# EAGLE schematic axiom_beta_power_board_v2.23.72e5f046 (EAGLE 7.7.0), part 2 of 2
## Sheet 14 of 17
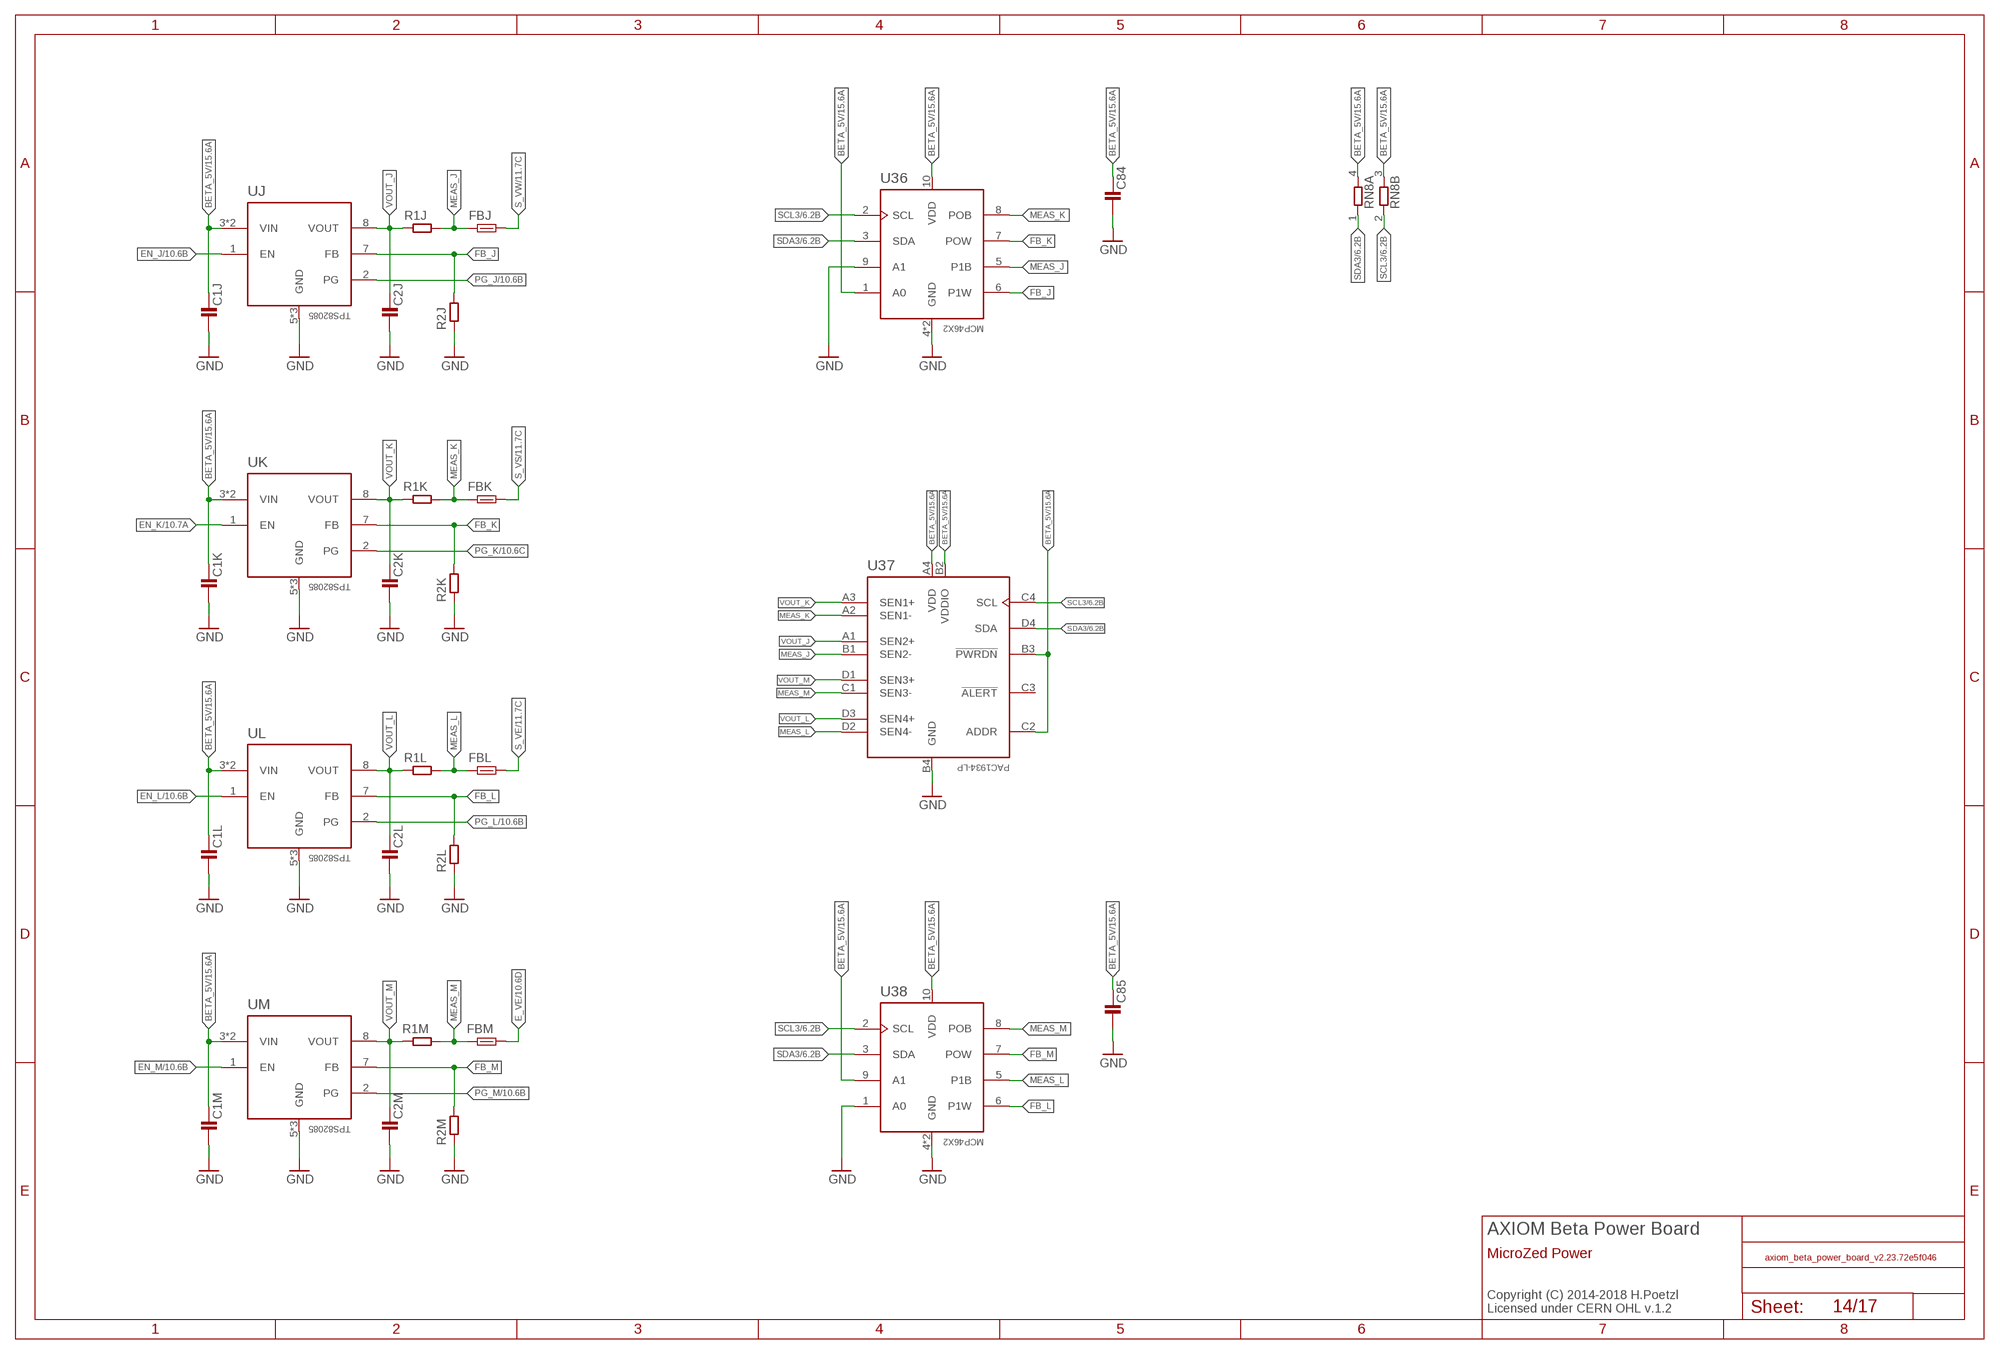
[diagram p14: schematic, sheet 14]

### Parts
C1J  C0603-C  [0603-C]
C1K  C0603-C  [0603-C]
C1L  C0603-C  [0603-C]
C1M  C0603-C  [0603-C]
C2J  C0603-C  [0603-C]
C2K  C0603-C  [0603-C]
C2L  C0603-C  [0603-C]
C2M  C0603-C  [0603-C]
C84  C0402-C  [0402-C]
C85  C0402-C  [0402-C]
FBJ  FB0603-C  [0603-C]
FBK  FB0603-C  [0603-C]
FBL  FB0603-C  [0603-C]
FBM  FB0603-C  [0603-C]
R1J  R0603-C  [0603-C]
R1K  R0603-C  [0603-C]
R1L  R0603-C  [0603-C]
R1M  R0603-C  [0603-C]
R2J  R0402-C  [0402-C]
R2K  R0402-C  [0402-C]
R2L  R0402-C  [0402-C]
R2M  R0402-C  [0402-C]
RN8  2R-NEXB24V  [EXB24V]
U36  MCP46X2  [DFN-10]
U37  PAC1934-LP  [WLCSP-16-LP]
U38  MCP46X2  [DFN-10]
UJ  TPS82085  [MICROSIP]
UK  TPS82085  [MICROSIP]
UL  TPS82085  [MICROSIP]
UM  TPS82085  [MICROSIP]

### Nets
BETA_5V: C1J.1 C1K.1 C1L.1 C1M.1 C84.1 C85.1 RN8.3 RN8.4 U36.1(A0) U36.10(VDD) U37.A4(VDD) U37.B2(VDDIO) U37.B3(!PWRDN) U37.C2(ADDR) U38.9(A1) U38.10(VDD) UJ.3(VIN) UJ.4(VIN) UK.3(VIN) UK.4(VIN) UL.3(VIN) UL.4(VIN) UM.3(VIN) UM.4(VIN) ; also sheet 6,7,8,12,13,15,16,17
E_VE: FBM.2 ; also sheet 10,11
EN_J: UJ.1(EN) ; also sheet 10
EN_K: UK.1(EN) ; also sheet 10
EN_L: UL.1(EN) ; also sheet 10
EN_M: UM.1(EN) ; also sheet 10
FB_J: R2J.2 U36.6(P1W) UJ.7(FB)
FB_K: R2K.2 U36.7(POW) UK.7(FB)
FB_L: R2L.2 U38.6(P1W) UL.7(FB)
FB_M: R2M.2 U38.7(POW) UM.7(FB)
GND: C1J.2 C1K.2 C1L.2 C1M.2 C2J.2 C2K.2 C2L.2 C2M.2 C84.2 C85.2 R2J.1 R2K.1 R2L.1 R2M.1 U36.4(GND) U36.9(A1) U36.EP(GND) U37.B4(GND) U38.1(A0) U38.4(GND) U38.EP(GND) UJ.5(GND) UJ.6(GND) UJ.EP(GND) UK.5(GND) UK.6(GND) UK.EP(GND) UL.5(GND) UL.6(GND) UL.EP(GND) UM.5(GND) UM.6(GND) UM.EP(GND) ; also sheet 2,3,5,6,7,8,9,10,11,12,13,15,16,17
MEAS_J: FBJ.1 R1J.2 U36.5(P1B) U37.B1(SEN2-)
MEAS_K: FBK.1 R1K.2 U36.8(POB) U37.A2(SEN1-)
MEAS_L: FBL.1 R1L.2 U37.D2(SEN4-) U38.5(P1B)
MEAS_M: FBM.1 R1M.2 U37.C1(SEN3-) U38.8(POB)
PG_J: UJ.2(PG) ; also sheet 10
PG_K: UK.2(PG) ; also sheet 10
PG_L: UL.2(PG) ; also sheet 10
PG_M: UM.2(PG) ; also sheet 10
S_VE: FBL.2 ; also sheet 11
S_VS: FBK.2 ; also sheet 11
S_VW: FBJ.2 ; also sheet 11
SCL3: RN8.2 U36.2(SCL) U37.C4(SCL) U38.2(SCL) ; also sheet 6,10
SDA3: RN8.1 U36.3(SDA) U37.D4(SDA) U38.3(SDA) ; also sheet 6,10
VOUT_J: C2J.1 R1J.1 U37.A1(SEN2+) UJ.8(VOUT)
VOUT_K: C2K.1 R1K.1 U37.A3(SEN1+) UK.8(VOUT)
VOUT_L: C2L.1 R1L.1 U37.D3(SEN4+) UL.8(VOUT)
VOUT_M: C2M.1 R1M.1 U37.D1(SEN3+) UM.8(VOUT)
Unconnected: U37.C3(!ALERT)

### Notes on the sheet
- AXIOM Beta Power Board
- MicroZed Power
- Copyright (C) 2014-2018 H.Poetzl
  Licensed under CERN OHL v.1.2

## Sheet 15 of 17
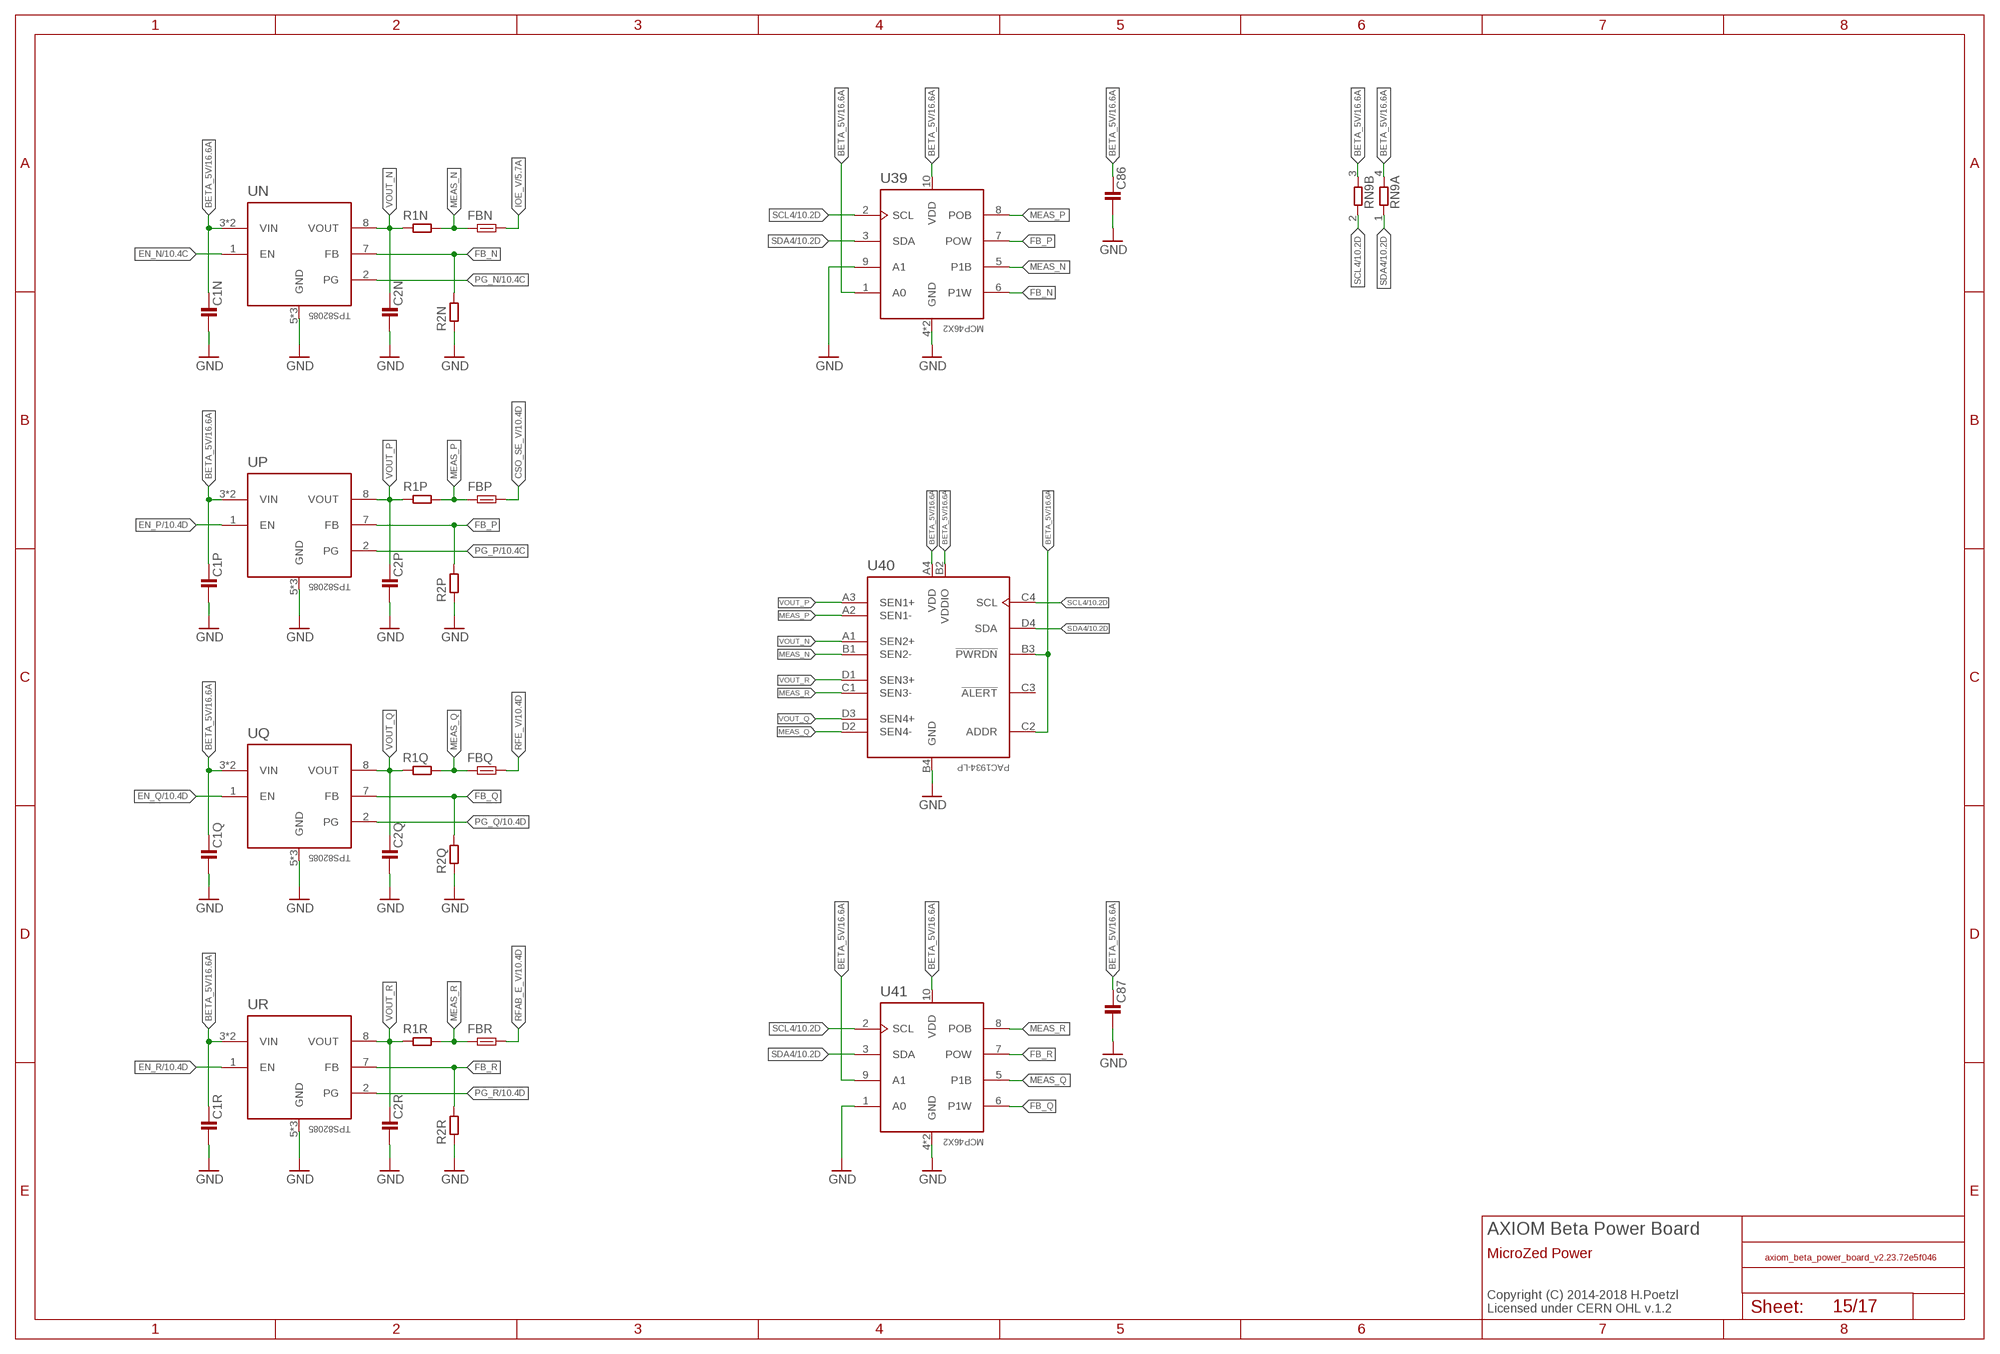
[diagram p15: schematic, sheet 15]

### Parts
C1N  C0603-C  [0603-C]
C1P  C0603-C  [0603-C]
C1Q  C0603-C  [0603-C]
C1R  C0603-C  [0603-C]
C2N  C0603-C  [0603-C]
C2P  C0603-C  [0603-C]
C2Q  C0603-C  [0603-C]
C2R  C0603-C  [0603-C]
C86  C0402-C  [0402-C]
C87  C0402-C  [0402-C]
FBN  FB0603-C  [0603-C]
FBP  FB0603-C  [0603-C]
FBQ  FB0603-C  [0603-C]
FBR  FB0603-C  [0603-C]
R1N  R0603-C  [0603-C]
R1P  R0603-C  [0603-C]
R1Q  R0603-C  [0603-C]
R1R  R0603-C  [0603-C]
R2N  R0402-C  [0402-C]
R2P  R0402-C  [0402-C]
R2Q  R0402-C  [0402-C]
R2R  R0402-C  [0402-C]
RN9  2R-NEXB24V  [EXB24V]
U39  MCP46X2  [DFN-10]
U40  PAC1934-LP  [WLCSP-16-LP]
U41  MCP46X2  [DFN-10]
UN  TPS82085  [MICROSIP]
UP  TPS82085  [MICROSIP]
UQ  TPS82085  [MICROSIP]
UR  TPS82085  [MICROSIP]

### Nets
BETA_5V: C1N.1 C1P.1 C1Q.1 C1R.1 C86.1 C87.1 RN9.3 RN9.4 U39.1(A0) U39.10(VDD) U40.A4(VDD) U40.B2(VDDIO) U40.B3(!PWRDN) U40.C2(ADDR) U41.9(A1) U41.10(VDD) UN.3(VIN) UN.4(VIN) UP.3(VIN) UP.4(VIN) UQ.3(VIN) UQ.4(VIN) UR.3(VIN) UR.4(VIN) ; also sheet 6,7,8,12,13,14,16,17
CSO_SE_V: FBP.2 ; also sheet 10,11
EN_N: UN.1(EN) ; also sheet 10
EN_P: UP.1(EN) ; also sheet 10
EN_Q: UQ.1(EN) ; also sheet 10
EN_R: UR.1(EN) ; also sheet 10
FB_N: R2N.2 U39.6(P1W) UN.7(FB)
FB_P: R2P.2 U39.7(POW) UP.7(FB)
FB_Q: R2Q.2 U41.6(P1W) UQ.7(FB)
FB_R: R2R.2 U41.7(POW) UR.7(FB)
GND: C1N.2 C1P.2 C1Q.2 C1R.2 C2N.2 C2P.2 C2Q.2 C2R.2 C86.2 C87.2 R2N.1 R2P.1 R2Q.1 R2R.1 U39.4(GND) U39.9(A1) U39.EP(GND) U40.B4(GND) U41.1(A0) U41.4(GND) U41.EP(GND) UN.5(GND) UN.6(GND) UN.EP(GND) UP.5(GND) UP.6(GND) UP.EP(GND) UQ.5(GND) UQ.6(GND) UQ.EP(GND) UR.5(GND) UR.6(GND) UR.EP(GND) ; also sheet 2,3,5,6,7,8,9,10,11,12,13,14,16,17
IOE_V: FBN.2 ; also sheet 5,10,11
MEAS_N: FBN.1 R1N.2 U39.5(P1B) U40.B1(SEN2-)
MEAS_P: FBP.1 R1P.2 U39.8(POB) U40.A2(SEN1-)
MEAS_Q: FBQ.1 R1Q.2 U40.D2(SEN4-) U41.5(P1B)
MEAS_R: FBR.1 R1R.2 U40.C1(SEN3-) U41.8(POB)
PG_N: UN.2(PG) ; also sheet 10
PG_P: UP.2(PG) ; also sheet 10
PG_Q: UQ.2(PG) ; also sheet 10
PG_R: UR.2(PG) ; also sheet 10
RFAB_E_V: FBR.2 ; also sheet 10,11
RFE_V: FBQ.2 ; also sheet 10,11
SCL4: RN9.2 U39.2(SCL) U40.C4(SCL) U41.2(SCL) ; also sheet 10
SDA4: RN9.1 U39.3(SDA) U40.D4(SDA) U41.3(SDA) ; also sheet 10
VOUT_N: C2N.1 R1N.1 U40.A1(SEN2+) UN.8(VOUT)
VOUT_P: C2P.1 R1P.1 U40.A3(SEN1+) UP.8(VOUT)
VOUT_Q: C2Q.1 R1Q.1 U40.D3(SEN4+) UQ.8(VOUT)
VOUT_R: C2R.1 R1R.1 U40.D1(SEN3+) UR.8(VOUT)
Unconnected: U40.C3(!ALERT)

### Notes on the sheet
- AXIOM Beta Power Board
- MicroZed Power
- Copyright (C) 2014-2018 H.Poetzl
  Licensed under CERN OHL v.1.2

## Sheet 16 of 17
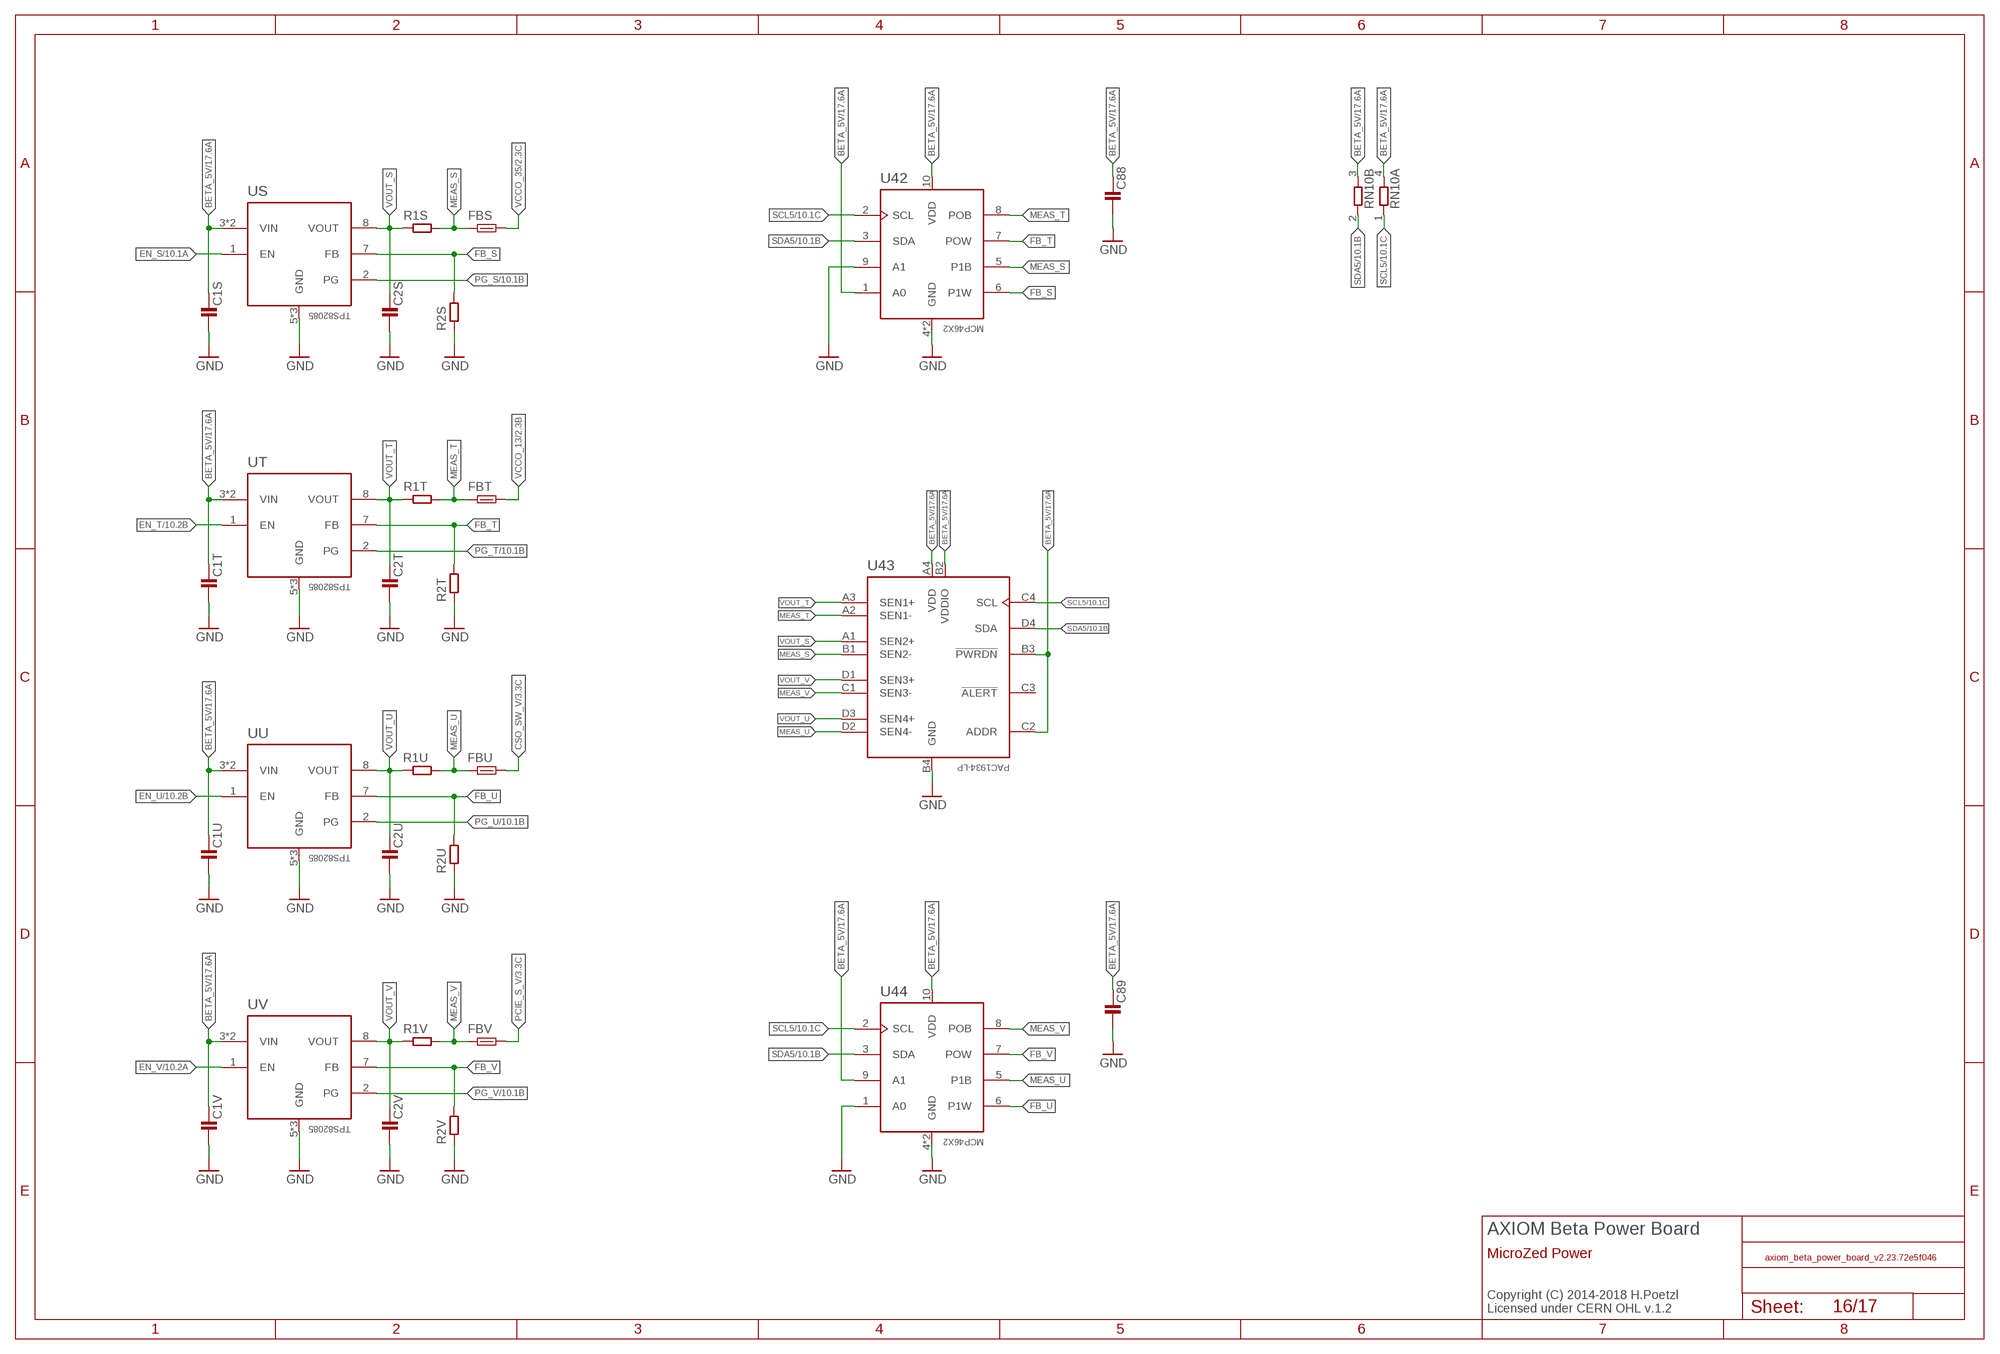
[diagram p16: schematic, sheet 16]

### Parts
C1S  C0603-C  [0603-C]
C1T  C0603-C  [0603-C]
C1U  C0603-C  [0603-C]
C1V  C0603-C  [0603-C]
C2S  C0603-C  [0603-C]
C2T  C0603-C  [0603-C]
C2U  C0603-C  [0603-C]
C2V  C0603-C  [0603-C]
C88  C0402-C  [0402-C]
C89  C0402-C  [0402-C]
FBS  FB0603-C  [0603-C]
FBT  FB0603-C  [0603-C]
FBU  FB0603-C  [0603-C]
FBV  FB0603-C  [0603-C]
R1S  R0603-C  [0603-C]
R1T  R0603-C  [0603-C]
R1U  R0603-C  [0603-C]
R1V  R0603-C  [0603-C]
R2S  R0402-C  [0402-C]
R2T  R0402-C  [0402-C]
R2U  R0402-C  [0402-C]
R2V  R0402-C  [0402-C]
RN10  2R-NEXB24V  [EXB24V]
U42  MCP46X2  [DFN-10]
U43  PAC1934-LP  [WLCSP-16-LP]
U44  MCP46X2  [DFN-10]
US  TPS82085  [MICROSIP]
UT  TPS82085  [MICROSIP]
UU  TPS82085  [MICROSIP]
UV  TPS82085  [MICROSIP]

### Nets
BETA_5V: C1S.1 C1T.1 C1U.1 C1V.1 C88.1 C89.1 RN10.3 RN10.4 U42.1(A0) U42.10(VDD) U43.A4(VDD) U43.B2(VDDIO) U43.B3(!PWRDN) U43.C2(ADDR) U44.9(A1) U44.10(VDD) US.3(VIN) US.4(VIN) UT.3(VIN) UT.4(VIN) UU.3(VIN) UU.4(VIN) UV.3(VIN) UV.4(VIN) ; also sheet 6,7,8,12,13,14,15,17
CSO_SW_V: FBU.2 ; also sheet 3,10
EN_S: US.1(EN) ; also sheet 10
EN_T: UT.1(EN) ; also sheet 10
EN_U: UU.1(EN) ; also sheet 10
EN_V: UV.1(EN) ; also sheet 10
FB_S: R2S.2 U42.6(P1W) US.7(FB)
FB_T: R2T.2 U42.7(POW) UT.7(FB)
FB_U: R2U.2 U44.6(P1W) UU.7(FB)
FB_V: R2V.2 U44.7(POW) UV.7(FB)
GND: C1S.2 C1T.2 C1U.2 C1V.2 C2S.2 C2T.2 C2U.2 C2V.2 C88.2 C89.2 R2S.1 R2T.1 R2U.1 R2V.1 U42.4(GND) U42.9(A1) U42.EP(GND) U43.B4(GND) U44.1(A0) U44.4(GND) U44.EP(GND) US.5(GND) US.6(GND) US.EP(GND) UT.5(GND) UT.6(GND) UT.EP(GND) UU.5(GND) UU.6(GND) UU.EP(GND) UV.5(GND) UV.6(GND) UV.EP(GND) ; also sheet 2,3,5,6,7,8,9,10,11,12,13,14,15,17
MEAS_S: FBS.1 R1S.2 U42.5(P1B) U43.B1(SEN2-)
MEAS_T: FBT.1 R1T.2 U42.8(POB) U43.A2(SEN1-)
MEAS_U: FBU.1 R1U.2 U43.D2(SEN4-) U44.5(P1B)
MEAS_V: FBV.1 R1V.2 U43.C1(SEN3-) U44.8(POB)
PCIE_S_V: FBV.2 ; also sheet 3,10
PG_S: US.2(PG) ; also sheet 10
PG_T: UT.2(PG) ; also sheet 10
PG_U: UU.2(PG) ; also sheet 10
PG_V: UV.2(PG) ; also sheet 10
SCL5: RN10.1 U42.2(SCL) U43.C4(SCL) U44.2(SCL) ; also sheet 10
SDA5: RN10.2 U42.3(SDA) U43.D4(SDA) U44.3(SDA) ; also sheet 10
VCCO_13 [LVDS]: FBT.2 ; also sheet 2,10
VCCO_35: FBS.2 ; also sheet 2,8,9,10
VOUT_S: C2S.1 R1S.1 U43.A1(SEN2+) US.8(VOUT)
VOUT_T: C2T.1 R1T.1 U43.A3(SEN1+) UT.8(VOUT)
VOUT_U: C2U.1 R1U.1 U43.D3(SEN4+) UU.8(VOUT)
VOUT_V: C2V.1 R1V.1 U43.D1(SEN3+) UV.8(VOUT)
Unconnected: U43.C3(!ALERT)

### Notes on the sheet
- AXIOM Beta Power Board
- MicroZed Power
- Copyright (C) 2014-2018 H.Poetzl
  Licensed under CERN OHL v.1.2

## Sheet 17 of 17
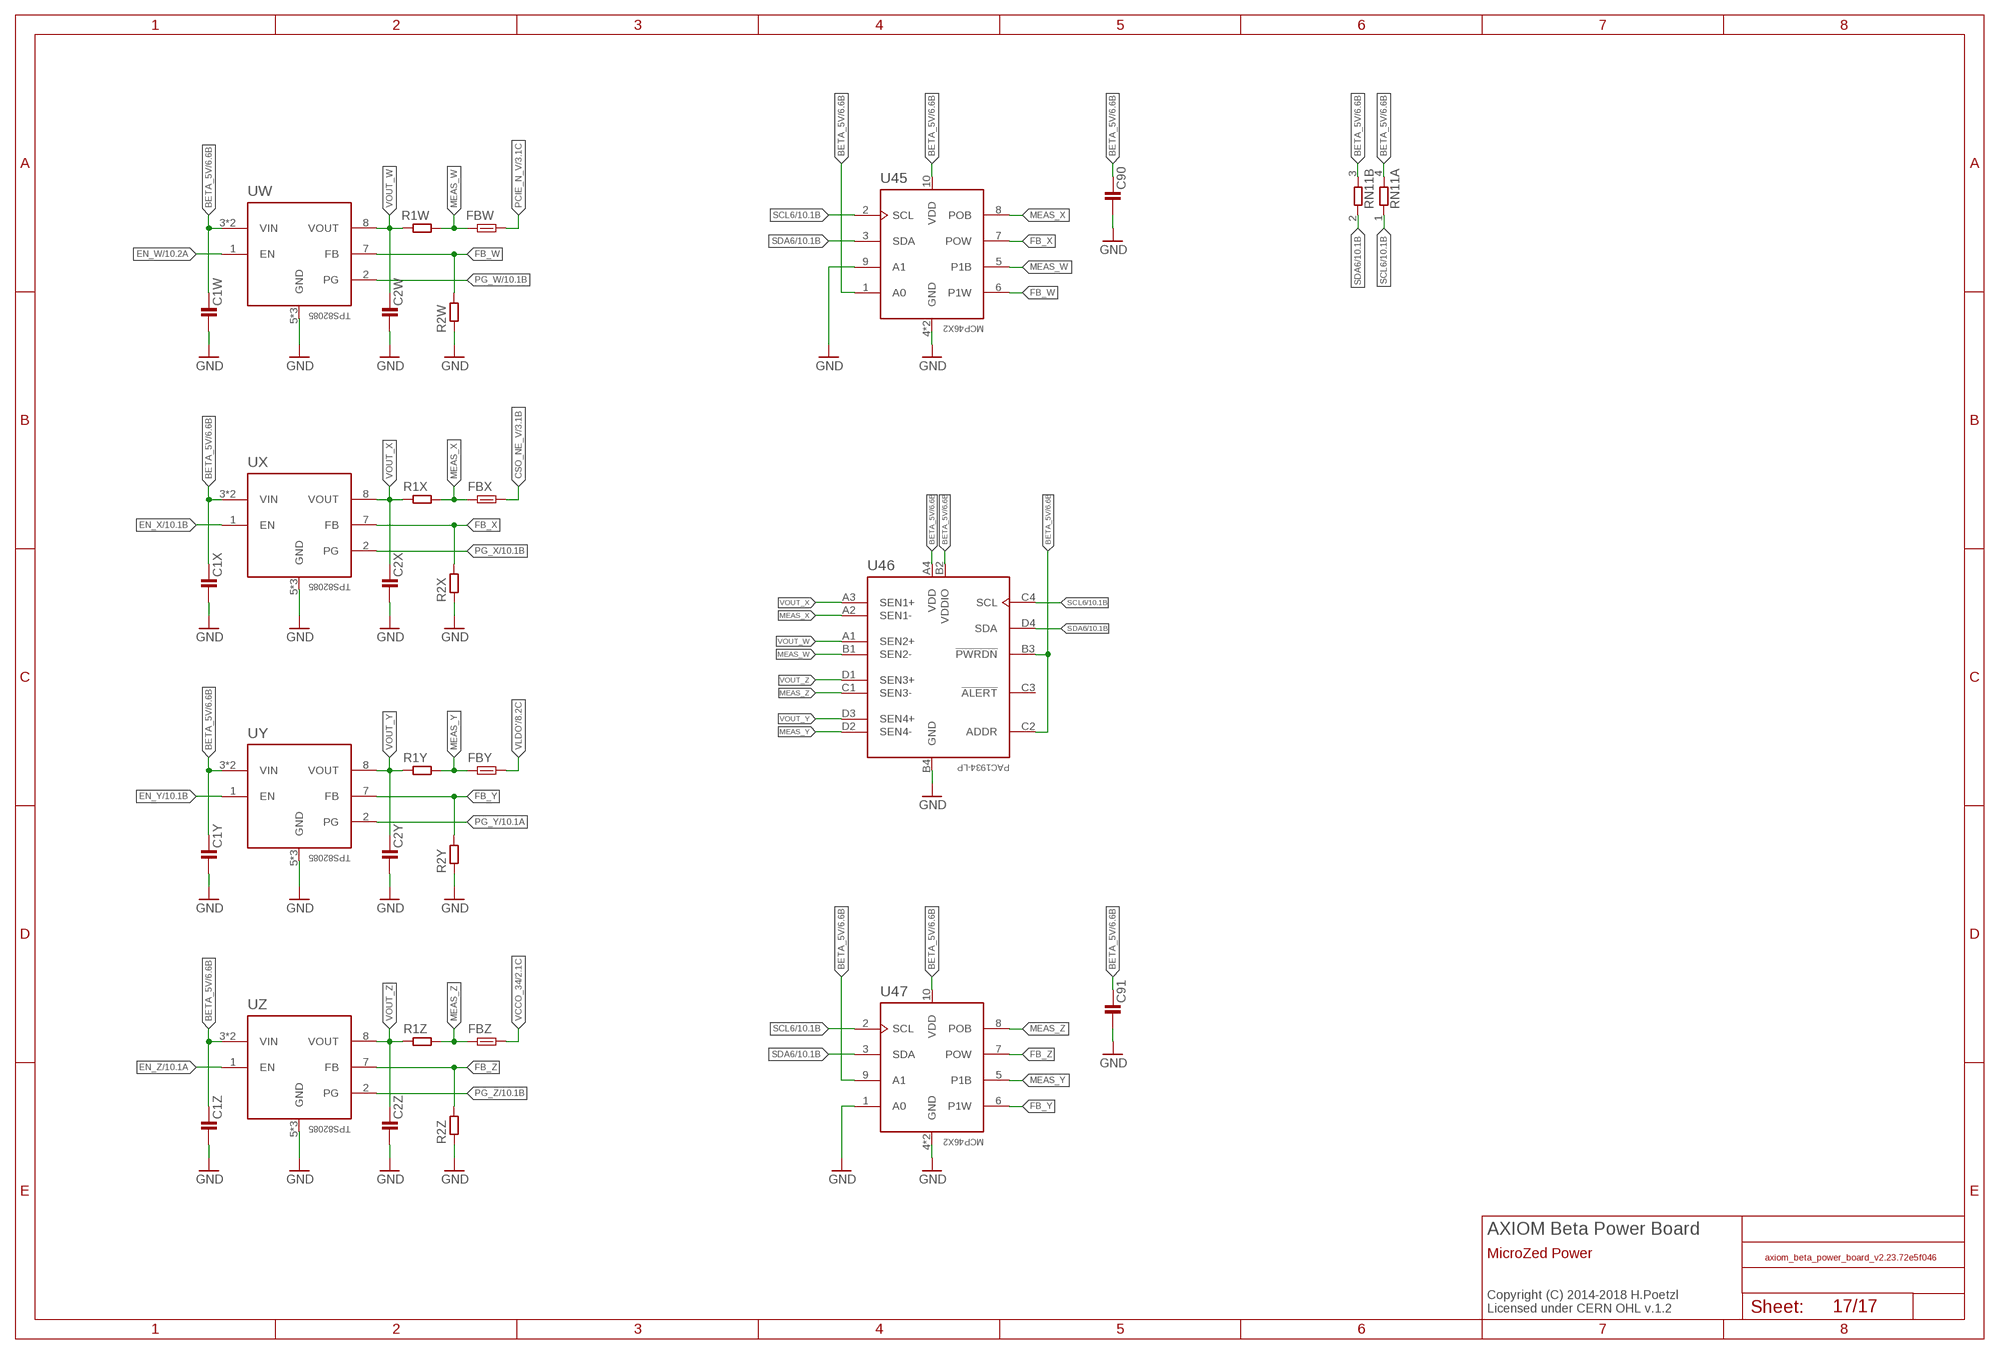
[diagram p17: schematic, sheet 17]

### Parts
C1W  C0603-C  [0603-C]
C1X  C0603-C  [0603-C]
C1Y  C0603-C  [0603-C]
C1Z  C0603-C  [0603-C]
C2W  C0603-C  [0603-C]
C2X  C0603-C  [0603-C]
C2Y  C0603-C  [0603-C]
C2Z  C0603-C  [0603-C]
C90  C0402-C  [0402-C]
C91  C0402-C  [0402-C]
FBW  FB0603-C  [0603-C]
FBX  FB0603-C  [0603-C]
FBY  FB0603-C  [0603-C]
FBZ  FB0603-C  [0603-C]
R1W  R0603-C  [0603-C]
R1X  R0603-C  [0603-C]
R1Y  R0603-C  [0603-C]
R1Z  R0603-C  [0603-C]
R2W  R0402-C  [0402-C]
R2X  R0402-C  [0402-C]
R2Y  R0402-C  [0402-C]
R2Z  R0402-C  [0402-C]
RN11  2R-NEXB24V  [EXB24V]
U45  MCP46X2  [DFN-10]
U46  PAC1934-LP  [WLCSP-16-LP]
U47  MCP46X2  [DFN-10]
UW  TPS82085  [MICROSIP]
UX  TPS82085  [MICROSIP]
UY  TPS82085  [MICROSIP]
UZ  TPS82085  [MICROSIP]

### Nets
BETA_5V: C1W.1 C1X.1 C1Y.1 C1Z.1 C90.1 C91.1 RN11.3 RN11.4 U45.1(A0) U45.10(VDD) U46.A4(VDD) U46.B2(VDDIO) U46.B3(!PWRDN) U46.C2(ADDR) U47.9(A1) U47.10(VDD) UW.3(VIN) UW.4(VIN) UX.3(VIN) UX.4(VIN) UY.3(VIN) UY.4(VIN) UZ.3(VIN) UZ.4(VIN) ; also sheet 6,7,8,12,13,14,15,16
CSO_NE_V: FBX.2 ; also sheet 3,10
EN_W: UW.1(EN) ; also sheet 10
EN_X: UX.1(EN) ; also sheet 10
EN_Y: UY.1(EN) ; also sheet 10
EN_Z: UZ.1(EN) ; also sheet 10
FB_W: R2W.2 U45.6(P1W) UW.7(FB)
FB_X: R2X.2 U45.7(POW) UX.7(FB)
FB_Y: R2Y.2 U47.6(P1W) UY.7(FB)
FB_Z: R2Z.2 U47.7(POW) UZ.7(FB)
GND: C1W.2 C1X.2 C1Y.2 C1Z.2 C2W.2 C2X.2 C2Y.2 C2Z.2 C90.2 C91.2 R2W.1 R2X.1 R2Y.1 R2Z.1 U45.4(GND) U45.9(A1) U45.EP(GND) U46.B4(GND) U47.1(A0) U47.4(GND) U47.EP(GND) UW.5(GND) UW.6(GND) UW.EP(GND) UX.5(GND) UX.6(GND) UX.EP(GND) UY.5(GND) UY.6(GND) UY.EP(GND) UZ.5(GND) UZ.6(GND) UZ.EP(GND) ; also sheet 2,3,5,6,7,8,9,10,11,12,13,14,15,16
MEAS_W: FBW.1 R1W.2 U45.5(P1B) U46.B1(SEN2-)
MEAS_X: FBX.1 R1X.2 U45.8(POB) U46.A2(SEN1-)
MEAS_Y: FBY.1 R1Y.2 U46.D2(SEN4-) U47.5(P1B)
MEAS_Z: FBZ.1 R1Z.2 U46.C1(SEN3-) U47.8(POB)
PCIE_N_V: FBW.2 ; also sheet 3,10
PG_W: UW.2(PG) ; also sheet 10
PG_X: UX.2(PG) ; also sheet 10
PG_Y: UY.2(PG) ; also sheet 10
PG_Z: UZ.2(PG) ; also sheet 10
SCL6: RN11.1 U45.2(SCL) U46.C4(SCL) U47.2(SCL) ; also sheet 10
SDA6: RN11.2 U45.3(SDA) U46.D4(SDA) U47.3(SDA) ; also sheet 10
VCCO_34: FBZ.2 ; also sheet 2,8,9,10
VLDO': FBY.2 ; also sheet 8
VOUT_W: C2W.1 R1W.1 U46.A1(SEN2+) UW.8(VOUT)
VOUT_X: C2X.1 R1X.1 U46.A3(SEN1+) UX.8(VOUT)
VOUT_Y: C2Y.1 R1Y.1 U46.D3(SEN4+) UY.8(VOUT)
VOUT_Z: C2Z.1 R1Z.1 U46.D1(SEN3+) UZ.8(VOUT)
Unconnected: U46.C3(!ALERT)

### Notes on the sheet
- AXIOM Beta Power Board
- MicroZed Power
- Copyright (C) 2014-2018 H.Poetzl
  Licensed under CERN OHL v.1.2

## Library data of the parts
BETA ZED = microzed:µZ-FCI
C1 C1A C1B C1C C1D C1E C1F C1G C1H C1J C1K C1L C1M C1N C1P C1Q C1R C1S C1T C1U C1V C1W C1X C1Y C1Z C2 C2A C2B C2C C2D C2E C2F C2G C2H C2J C2K C2L C2M C2N C2P C2Q C2R C2S C2T C2U C2V C2W C2X C2Y C2Z C3-C45 C48-C91 = generic-rcl:C
CN1 = array:2C-N
CNW CSE = spx3819:SPX3819M5-L: 500mA, LOW-NOISE LDO VOLTAGE REGULATOR; MPN: SPX3819M5-L; OC_FARNELL: 1831948; OC_NEWARK: 23R9689; PACKAGE: SOT-23-5; SUPPLIER: EXAR
D1-D4 = pmeg2010beld:PMEG2010BELD
DS1-DS4 R1 R1A R1B R1C R1D R1E R1F R1G R1H R1J R1K R1L R1M R1N R1P R1Q R1R R1S R1T R1U R1V R1W R1X R1Y R1Z R2 R2A R2B R2C R2D R2E R2F R2G R2H R2J R2K R2L R2M R2N R2P R2Q R2R R2S R2T R2U R2V R2W R2X R2Y R2Z R3-R16 R19-R25 = generic-rcl:R
EXT = pinhead-2:PINHD-2X02: PIN HEADER
F1-F8 = fiducial:FIDUCIAL: Fiducials
FB1 FB2 FBA FBB FBC FBD FBE FBF FBG FBH FBJ FBK FBL FBM FBN FBP FBQ FBR FBS FBT FBU FBV FBW FBX FBY FBZ = generic-rcl:FB
IOC = pic16f15386:PIC16F15386
LED = led:RGB-LED
LOGO1 = ohw-logo:OSHW_LOGO_FILL
PB-NW PB-SE = df12:DF12(XX)-20DP-0.5V
PM1-PM5 = pic16f1779:PIC16F1779
PMC = pic16f15386:PIC16F15356
PWR-NE PWR-NW PWR-SE PWR-SW = pincon:PINRC-2X04: WR-PHD 2.54mm SMT Dual Socket Header Bottom Entry, 8 Pins=>Code : Con_BTB_SHD_2.54_2_610008243021 <http://katalog.we-online.de/media/images/eican/Con_BTB_SHD_2.54_2_6100xx243021_pf2.jpg> Details see: http://katalog.we-online.de/en/em/610_0xx_243_021 Created 2014-05-30, Karrer Zheng 2014 (C) Würth Elektronik
Q1-Q3 = transistor:NX3008N: 30 V, single N-channel Trench MOSFET Herbert Poetzl
RN1 RN2 = resistor-dil:4R-N: Array Chip Resistor Source: RS Component / Phycomp; OC_FARNELL: unknown; OC_NEWARK: unknown
RN3-RN14 = array:2R-N: Array Chip Resistor Source: Panasonic; OC_FARNELL: unknown; OC_NEWARK: unknown
S1 = switch:SKSNLAE010
SD1 = micro-sd:MICRO-SD-2CD
U1 U2 = gtl2002:PCA9306: Bidirectional low voltage translator,SOIC-8
U3 = emifil:IP4251CZ16-8-TTL: passive filter network; MPN: IP4251CZ16-8-TTL; OC_FARNELL: 1972684; OC_NEWARK: 58T9585; PACKAGE: SON-16; SUPPLIER: NXP
U4 U6 = lm75:MCP9808
U5 = eeprom:BR24G04
U7 U8 = AP22966:AP22966: Buck/Boost Charge Pump 60mA
U9 U12 U14 = load_switch:MIC94040: Voltage Regulator LDO Standard 150mA LDO voltage regulator in SOT-23 layout. Micrel part MIC5205. BP (by-pass) pin is used to lower output noise with 470pF cap.
U10 U16 = ntlud4c26n:NTLUD4C26N
U11 U18 = ltc4365:LTC4365: IC, DAC, 12BIT, QUAD
U13 U22 = pmeg2020cpas:PMEG2020CPAS
U15 = lt1965:LT1965: Low Dropout Regulator
U17 U31 U34 U37 U40 U43 U46 = pac1934:PAC1934
U19 = ft23x:FT231
U20 U23 = lvltrans:TXS0102
U21 = lvltrans:FXLH1T45
U24-U29 = ldo:LDO_DUAL: Dual Output SOT23-6 Linear Regulators Diodes Inc. AP7312 - Dual 150mA LDO Linear Regulator 0.2V dropout, 150mA output, 2-6V Input AP7312-1833W6-7 - 1.8V/3.3V SOT23-6 (Digikey: AP7312-1833W6-7DICT-ND) MIC5320 - Dual 150mA ULDO Linear Regulator Ultra-low 35mV dropout at 150mA, 2.3-5.5V Input 3.3V/1.8V SOT23-6 (Digikey: 576-1658-1-ND) 3.3V/1.5V SOT23-6 (Digikey: 576-3483-1-ND)
U30 U32 U33 U35 U36 U38 U39 U41 U42 U44 U45 U47 = digipot:MCP46X2: I2C Dual Rheostat 2.3-5.5V MCP4632 129 Taps, Volatile MCP4642 129 Taps, EEPROM MCP4652 257 Taps, Volatile MCP4662 257 Taps, EEPROM
UA UB UC UD UE UF UG UH UJ UK UL UM UN UP UQ UR US UT UU UV UW UX UY UZ = TPS82085:TPS82085: Buck/Boost Charge Pump 60mA
USB = usb:5_USB_3S; TE: 1981584
X1 = pico-spox:PICO-SPOX-5

## Net classes
1 LVDS: width 0.152 mm, drill 0.203 mm, clearance 0.152 mm